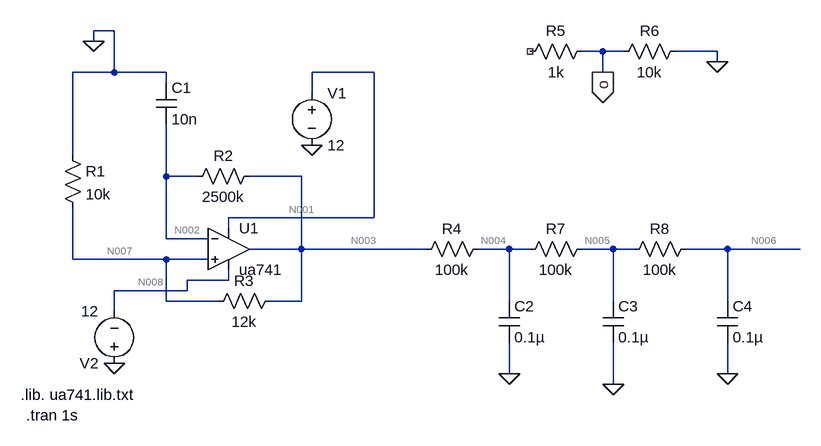
[diagram p0: schematic sinee.asc]
sinee.asc, the LTspice schematic file:
Version 4
SHEET 1 1108 680
WIRE 48 -176 16 -176
WIRE 16 -160 16 -176
WIRE 800 -144 768 -144
WIRE 832 -144 800 -144
WIRE 976 -144 912 -144
WIRE 976 -128 976 -144
WIRE 48 -112 48 -176
WIRE 48 -112 -16 -112
WIRE 128 -112 48 -112
WIRE 448 -112 352 -112
WIRE 800 -112 800 -144
WIRE 128 -96 128 -112
WIRE 352 -80 352 -112
WIRE -16 16 -16 -112
WIRE 128 48 128 -32
WIRE 176 48 128 48
WIRE 336 48 256 48
WIRE 448 112 448 -112
WIRE 448 112 224 112
WIRE 224 128 224 112
WIRE 128 144 128 48
WIRE 192 144 128 144
WIRE 336 160 336 48
WIRE 336 160 256 160
WIRE 528 160 336 160
WIRE 656 160 608 160
WIRE 688 160 656 160
WIRE 816 160 768 160
WIRE 848 160 816 160
WIRE 992 160 928 160
WIRE 1104 160 992 160
WIRE -16 176 -16 96
WIRE 128 176 -16 176
WIRE 192 176 128 176
WIRE 224 208 224 192
WIRE 224 208 160 208
WIRE 160 224 160 208
WIRE 160 224 48 224
WIRE 128 240 128 176
WIRE 208 240 128 240
WIRE 336 240 336 160
WIRE 336 240 288 240
WIRE 656 240 656 160
WIRE 816 240 816 160
WIRE 992 240 992 160
WIRE 48 256 48 224
WIRE 656 352 656 304
WIRE 992 352 992 304
WIRE 816 368 816 304
FLAG 16 -160 0
FLAG 48 336 0
FLAG 352 0 0
FLAG 976 -128 0
FLAG 800 -112 o
IOPIN 800 -112 Out
FLAG 656 352 0
FLAG 816 368 0
FLAG 992 352 0
SYMBOL res -32 0 R0
SYMATTR InstName R1
SYMATTR Value 10k
SYMBOL res 272 32 R90
WINDOW 0 0 56 VBottom 2
WINDOW 3 32 56 VTop 2
SYMATTR InstName R2
SYMATTR Value 2500k
SYMBOL cap 112 -96 R0
SYMATTR InstName C1
SYMATTR Value 10n
SYMBOL res 304 224 R90
WINDOW 0 0 56 VBottom 2
WINDOW 3 32 56 VTop 2
SYMATTR InstName R3
SYMATTR Value 12k
SYMBOL voltage 352 -96 R0
WINDOW 123 0 0 Left 0
WINDOW 39 0 0 Left 0
SYMATTR InstName V1
SYMATTR Value 12
SYMBOL voltage 48 352 R180
WINDOW 123 0 0 Left 0
WINDOW 39 0 0 Left 0
SYMATTR InstName V2
SYMATTR Value 12
SYMBOL OpAmps\\ua741 224 96 R0
SYMATTR InstName U1
SYMBOL res 928 -160 R90
WINDOW 0 0 56 VBottom 2
WINDOW 3 32 56 VTop 2
SYMATTR InstName R6
SYMATTR Value 10k
SYMBOL res 672 -128 R270
WINDOW 0 32 56 VTop 2
WINDOW 3 0 56 VBottom 2
SYMATTR InstName R5
SYMATTR Value 1k
SYMBOL res 624 144 R90
WINDOW 0 0 56 VBottom 2
WINDOW 3 32 56 VTop 2
SYMATTR InstName R4
SYMATTR Value 100k
SYMBOL res 784 144 R90
WINDOW 0 0 56 VBottom 2
WINDOW 3 32 56 VTop 2
SYMATTR InstName R7
SYMATTR Value 100k
SYMBOL res 944 144 R90
WINDOW 0 0 56 VBottom 2
WINDOW 3 32 56 VTop 2
SYMATTR InstName R8
SYMATTR Value 100k
SYMBOL cap 640 240 R0
SYMATTR InstName C2
SYMATTR Value 0.1µ
SYMBOL cap 800 240 R0
SYMATTR InstName C3
SYMATTR Value 0.1µ
SYMBOL cap 976 240 R0
SYMATTR InstName C4
SYMATTR Value 0.1µ
TEXT -88 416 Left 2 !.tran 1s
TEXT -96 384 Left 2 !.lib. ua741.lib.txt

The netlist it stands for:
* sinee.asc
R1 0 N007 10k
R2 N003 N002 2500k
C1 0 N002 10n
R3 N003 N007 12k
V1 N001 0 12
V2 0 N008 12
XU1 N007 N002 N001 N008 N003 ua741  ; pins In+ In- V+ V- OUT
R6 0 o 10k
R5 NC_01 o 1k
R4 N004 N003 100k
R7 N005 N004 100k
R8 N006 N005 100k
C2 N004 0 0.1µ
C3 N005 0 0.1µ
C4 N006 0 0.1µ
.tran 1s
.lib. ua741.lib.txt
.backanno
.end

* Results of the author's LTspice run, read from the files saved beside the schematic
* Operating Point, zero values left out:
*   V(n007) = 165.5 mV
*   V(n003) = 365.1 mV
*   V(n002) = 165.5 mV
*   V(n001) = 12 V
*   V(n008) = -12 V
*   V(n004) = 365.1 mV
*   V(n005) = 365.1 mV
*   V(n006) = 365.1 mV
*   I(R3) = 16.63 µA
*   I(R2) = 79.82 nA
*   I(R1) = -16.55 µA
*   I(V2) = -1.337 mA
*   I(V1) = -1.337 mA
*   Ix(u1:1) = 79.8 nA
*   Ix(u1:2) = 79.82 nA
*   Ix(u1:3) = 1.337 mA
*   Ix(u1:4) = -1.337 mA
*   Ix(u1:5) = -16.71 µA
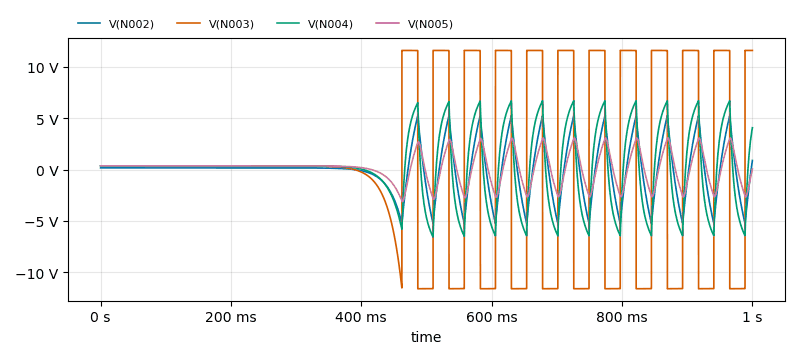
[diagram p1: Transient Analysis of sinee.asc, plotted from the saved traces]
* Transient Analysis, 1 run:
*   V(N002): min -5.251 V, max 5.25 V, average -42.72 mV, rms 2.347 V, last 889.9 mV
*   V(N003): min -11.62 V, max 11.62 V, average 170 mV, rms 8.591 V, last 11.61 V
*   V(N004): min -6.578 V, max 6.71 V, average 150.2 mV, rms 3.344 V, last 4.079 V
*   V(N005): min -3.119 V, max 3.089 V, average 168.1 mV, rms 1.397 V, last 62.04 mV